# Altium schematic sheet 顶板原理图.SchDoc
size A4
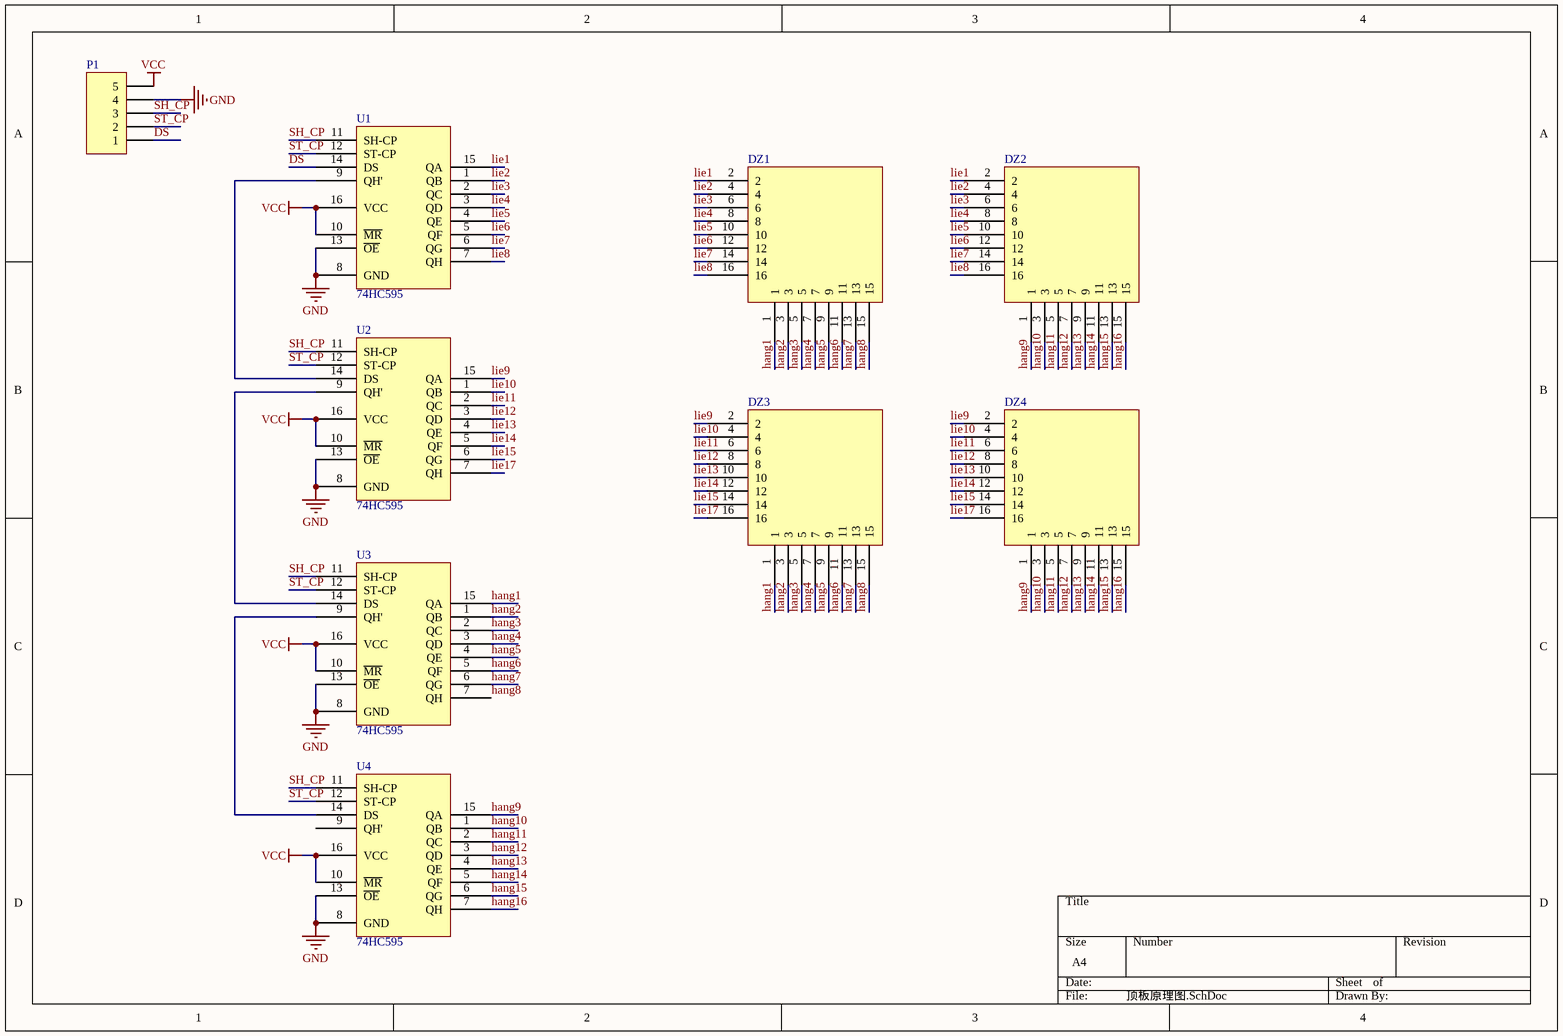
[diagram p0: 顶板原理图.SchDoc]

## Parts
DZ1  DianZhen  [DianZhen]  (value not drawn)
DZ2  DianZhen  [DianZhen]  (value not drawn)
DZ3  DianZhen  [DianZhen]  (value not drawn)
DZ4  DianZhen  [DianZhen]  (value not drawn)
P1  Header 5  [HDR1X5]  (value not drawn)
U1  74HC595  [SOIC16_L]
U2  74HC595  [SOIC16_L]
U3  74HC595  [SOIC16_L]
U4  74HC595  [SOIC16_L]

## Nets
GND: P1.4 U1.8(GND) U1.13(~{OE}) U2.8(GND) U2.13(~{OE}) U3.8(GND) U3.13(~{OE}) U4.8(GND) U4.13(~{OE})
VCC: P1.5 U1.10(~{MR}) U1.16(VCC) U2.10(~{MR}) U2.16(VCC) U3.10(~{MR}) U3.16(VCC) U4.10(~{MR}) U4.16(VCC)
DS: P1.1 U1.14(DS)
hang1: DZ1.1 DZ3.1 U3.15(QA)
hang2: DZ1.3 DZ3.3 U3.1(QB)
hang3: DZ1.5 DZ3.5 U3.2(QC)
hang4: DZ1.7 DZ3.7 U3.3(QD)
hang5: DZ1.9 DZ3.9 U3.4(QE)
hang6: DZ1.11 DZ3.11 U3.5(QF)
hang7: DZ1.13 DZ3.13 U3.6(QG)
hang8: DZ1.15 DZ3.15 U3.7(QH)
hang9: DZ2.1 DZ4.1 U4.15(QA)
hang10: DZ2.3 DZ4.3 U4.1(QB)
hang11: DZ2.5 DZ4.5 U4.2(QC)
hang12: DZ2.7 DZ4.7 U4.3(QD)
hang13: DZ2.9 DZ4.9 U4.4(QE)
hang14: DZ2.11 DZ4.11 U4.5(QF)
hang15: DZ2.13 DZ4.13 U4.6(QG)
hang16: DZ2.15 DZ4.15 U4.7(QH)
lie1: DZ1.2 DZ2.2 U1.15(QA)
lie2: DZ1.4 DZ2.4 U1.1(QB)
lie3: DZ1.6 DZ2.6 U1.2(QC)
lie4: DZ1.8 DZ2.8 U1.3(QD)
lie5: DZ1.10 DZ2.10 U1.4(QE)
lie6: DZ1.12 DZ2.12 U1.5(QF)
lie7: DZ1.14 DZ2.14 U1.6(QG)
lie8: DZ1.16 DZ2.16 U1.7(QH)
lie9: DZ3.2 DZ4.2 U2.15(QA)
lie10: DZ3.4 DZ4.4 U2.1(QB)
lie11: DZ3.6 DZ4.6 U2.2(QC)
lie12: DZ3.8 DZ4.8 U2.3(QD)
lie13: DZ3.10 DZ4.10 U2.4(QE)
lie14: DZ3.12 DZ4.12 U2.5(QF)
lie15: DZ3.14 DZ4.14 U2.6(QG)
lie17: DZ3.16 DZ4.16 U2.7(QH)
SH_CP: P1.3 U1.11(SH-CP) U2.11(SH-CP) U3.11(SH-CP) U4.11(SH-CP)
ST_CP: P1.2 U1.12(ST-CP) U2.12(ST-CP) U3.12(ST-CP) U4.12(ST-CP)
NetU1_9: U1.9(QH') U2.14(DS)
NetU2_9: U2.9(QH') U3.14(DS)
NetU3_9: U3.9(QH') U4.14(DS)

Not connected (* = marked no-connect by the designer): U4 9(QH')

## Library data of the parts
P1 = Header 5: Header, 5-Pin; LatestRevisionDate: 17-Jul-2002; LatestRevisionNote: Re-released for DXP Platform.; Publisher: Altium Limited